# EAGLE design Nixie_Bargraph (EAGLE 5.06)
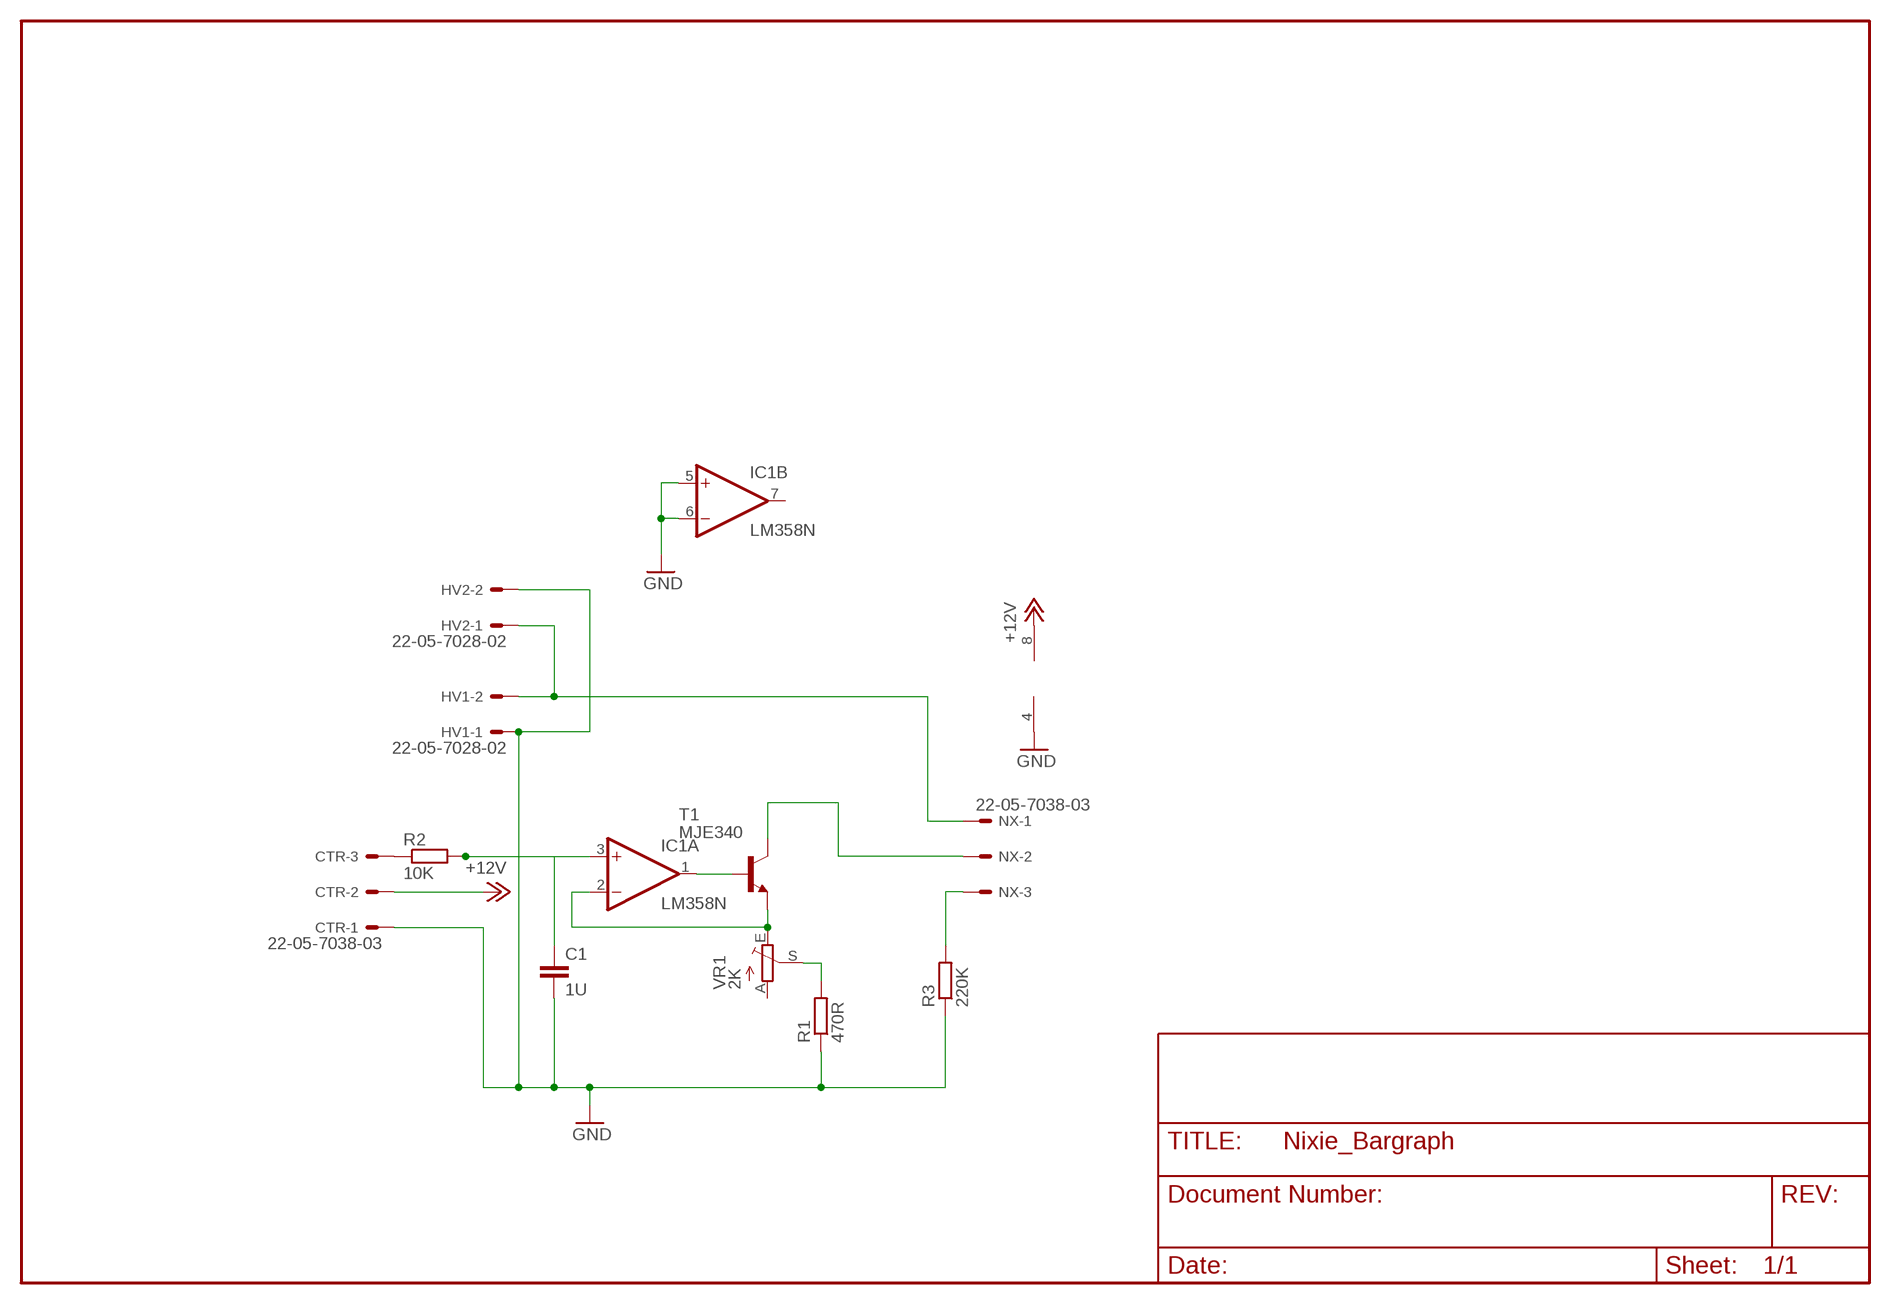
[diagram p0: schematic, sheet 1]

## Parts
C1  1U  C-EUC0805  [C0805]
CTR  22-05-7038-03  [7395-03]
HV1  22-05-7028-02  [7395-02]
HV2  22-05-7028-02  [7395-02]
IC1  LM358N  [DIL08]
NX  22-05-7038-03  [7395-03]
R1  470R  R-EU_M0805  [M0805]
R2  10K  R-EU_M0805  [M0805]
R3  220K  R-EU_M0805  [M0805]
T1  MJE340  [TO126]
VR1  2K  TRIM_EU-B64W  [B64W]

## Nets
+12V: CTR.2 IC1.8(P:V+)
GND: C1.2 CTR.1 HV1.1 HV2.2 IC1.4(P:V-) IC1.5(B:+IN) IC1.6(B:-IN) R1.1 R3.1
N$1: IC1.2(A:-IN) T1.1(E) VR1.E
N$2: R1.2 VR1.S
N$3: NX.3 R3.2
N$4: NX.2 T1.2(C)
N$5: HV1.2 HV2.1 NX.1
N$7: IC1.1(A:OUT) T1.3(B)
N$8: CTR.3 R2.1
N$9: C1.1 IC1.3(A:+IN) R2.2
Unconnected: IC1.7(B:OUT) VR1.A

## Library data of the parts
C1 = turbod3:C-EU: CAPACITOR, European symbol
CTR NX = con-molex:22-?-03: CONNECTOR wire to board 2.54 mm (.1 inch) pitch header
HV1 HV2 = con-molex:22-?-02: CONNECTOR wire to board 2.54 mm (.1 inch) pitch header
IC1 = linear:LM358: OP AMP also LM158; LM258; LM2904 Source: http://cache.national.com/ds/LM/LM158.pdf
R1-R3 = turbod3:R-EU_: RESISTOR, European symbol
T1 = transistor:MJE340: NPN TRANSISTOR
VR1 = pot:TRIM_EU-: POTENTIOMETER

## Board
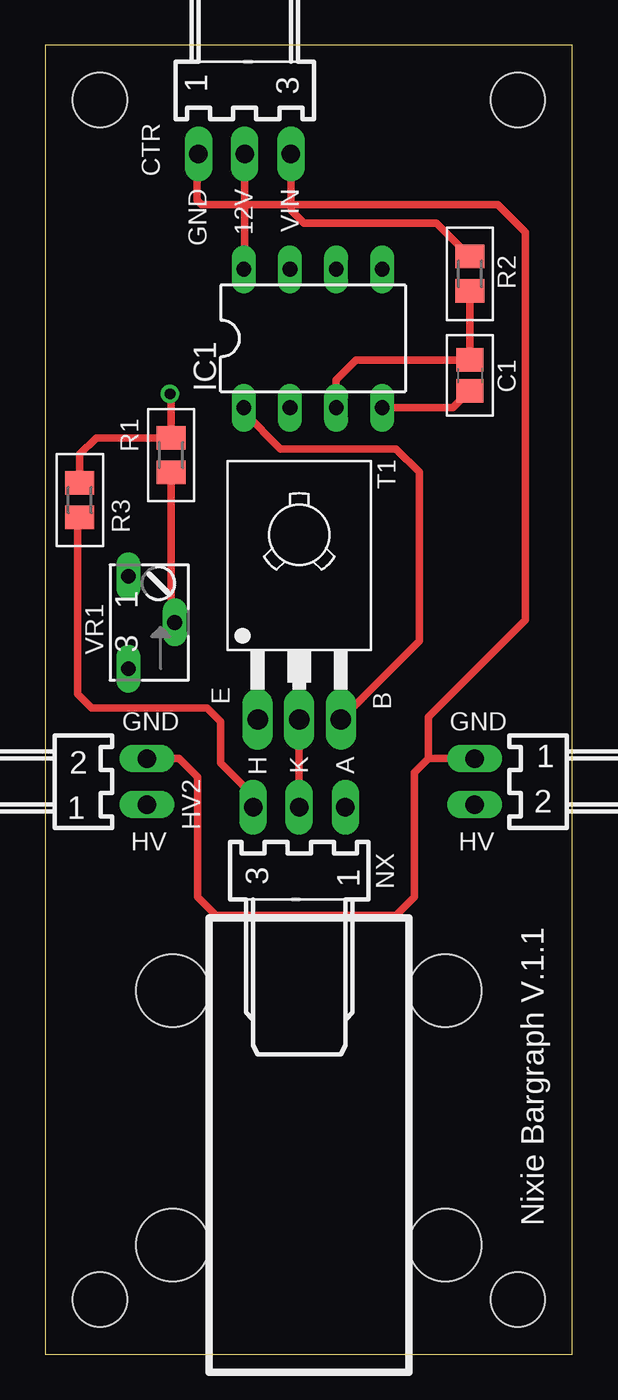
[diagram p1: board, top side]
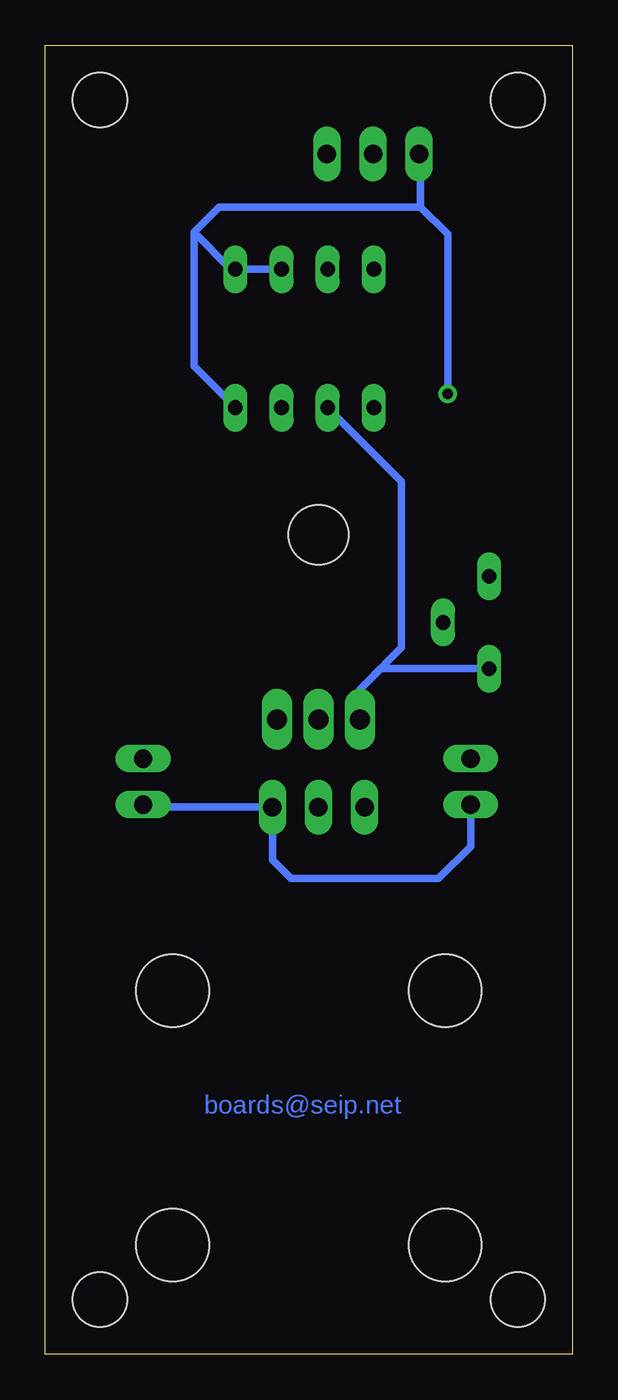
[diagram p2: board, bottom side, seen from below]

Size 29 x 72 mm. Coordinates in mm from the lower left corner, seen from the top.
Outline: 0,72 0,0 29,0 29,72 0,72
Copper layers (1*16): Top 0.035mm / dielectric 1.5mm / Bottom 0.035mm
Design rules "pcbcart-1": minimum track width 10mil, minimum drill 0.4mm, track to track 8mil, track to pad 8mil, pad to pad 8mil, via to via 8mil, smd to smd 8mil, copper to edge 40mil, drill to drill 0.3mm, minimum pad ring 10mil, minimum via ring 8mil, stop-mask expansion 0mil, vias tented up to drill 0mil, thermal gap 10mil
Holes 3 mm at 26,3 3,3 26,69 3,69
Holes 4 mm at 22,6 7,6 22,20 7,20

### Footprints (pad centres in the part's own frame; a part is rotated, then mirrored left to right if it is on the bottom)
C0805 = smd 1.3 x 1.5: 1 -0.85,0; 2 0.85,0
7395-03 = drill 1.016 long: 1 2.54,0; 2 0,0; 3 -2.54,0
7395-02 = drill 1.016 long: 1 1.27,0; 2 -1.27,0
DIL08 = drill 0.813 long: 1 -3.81,-3.81; 2 -1.27,-3.81; 3 1.27,-3.81; 4 3.81,-3.81; 5 3.81,3.81; 6 1.27,3.81; 7 -1.27,3.81; 8 -3.81,3.81
M0805 = smd 1.3 x 1.6: 1 -0.95,0; 2 0.95,0
TO126 = drill 1.118 long: 1 -2.286,-5.08; 2 0,-5.08; 3 2.286,-5.08 | hole 3.302: 0,5.08
B64W = drill 0.813 long: A 2.54,0; E -2.54,0; S 0,-2.54

### Placement (x,y rotation side)
C1  23.37,53.85 270 top
CTR  10.97,66.03 180 top
HV1  23.62,31.5 90 top
HV2  5.59,31.5 270 top
IC1  14.73,55.88 0 top
NX  13.97,30.09 0 top
R1  6.92,49.46 270 top
R2  23.37,59.44 270 top
R3  1.9,46.99 270 top
T1  13.97,40 0 top
VR1  4.57,40.25 90 top

### Tracks (layer width: path | path; a pad name or v marks a point on that pad's centre or on a via)
+12V
  Top 0.406: CTR.2 10.97,59.74 IC1.8
GND  (via drill 0.6)
  Top 0.406: R1.1 2.79,50.41 1.9,49.51 R3.1 | R1.1 7.41,50.41 | v6.86,52.83 6.92,52.77 R1.1 | C1.2 22.44,52.07 IC1.4 | HV2.2 7.37,32.77 8.38,31.75 8.38,25.15 9.4,24.13 19.3,24.13 20.32,25.15 20.32,32 21.08,32.77 | 21.08,32.77 HV1.1 | 21.08,32.77 21.08,35.05 26.42,40.39 26.42,44.2 26.42,61.72 24.89,63.25 8.6,63.25 8.35,63.5 8.35,65.95 CTR.1
  Bottom 0.406: CTR.1 8.35,66.03 8.35,63.11 | 8.35,63.11 17.81,63.11 19.44,63.11 20.83,61.72 | 8.35,63.11 6.86,61.62 v6.86,52.83 | IC1.4 20.83,54.36 20.83,61.72 | 20.83,61.72 18.8,59.69 IC1.5 IC1.6
N$1
  Bottom 0.406: IC1.2 11.68,50.29 9.4,48.01 9.4,38.86 11.3,36.96 | 11.3,36.96 11.68,36.58 T1.1 | VR1.E 10.55,37.71 11.3,36.96
N$2
  Top 0.406: R1.2 6.92,40.29 VR1.S
N$3
  Top 0.406: NX.3 11.43,30.73 9.65,32.51 9.65,34.8 8.89,35.56 2.54,35.56 1.78,36.32 1.78,45.92 R3.2
N$4
  Top 0.406: NX.2 T1.2
N$5
  Bottom 0.406: HV2.1 5.59,27.94 7.37,26.16 15.49,26.16 16.51,27.18 NX.1 23.49,30.09 HV1.2
N$7
  Top 0.406: IC1.1 10.92,51.82 12.95,49.78 19.3,49.78 20.57,48.51 20.57,39.23 T1.3
N$8
  Top 0.406: CTR.3 13.51,62.94 14.22,62.23 21.52,62.23 R2.1
N$9
  Top 0.406: R2.2 C1.1 17.11,54.7 16.51,54.1 16,53.59 16,53.09 IC1.3

### Text on the board
Bottom: boards@seip.net
tNames: GND | 12V | VIN | E | B | GND | GND | H | K | A | HV | HV | Nixie Bargraph V.1.1